# Altium schematic sheet Sheet1.SchDoc
size A4; SheetNumber: 1; SheetTotal: 1
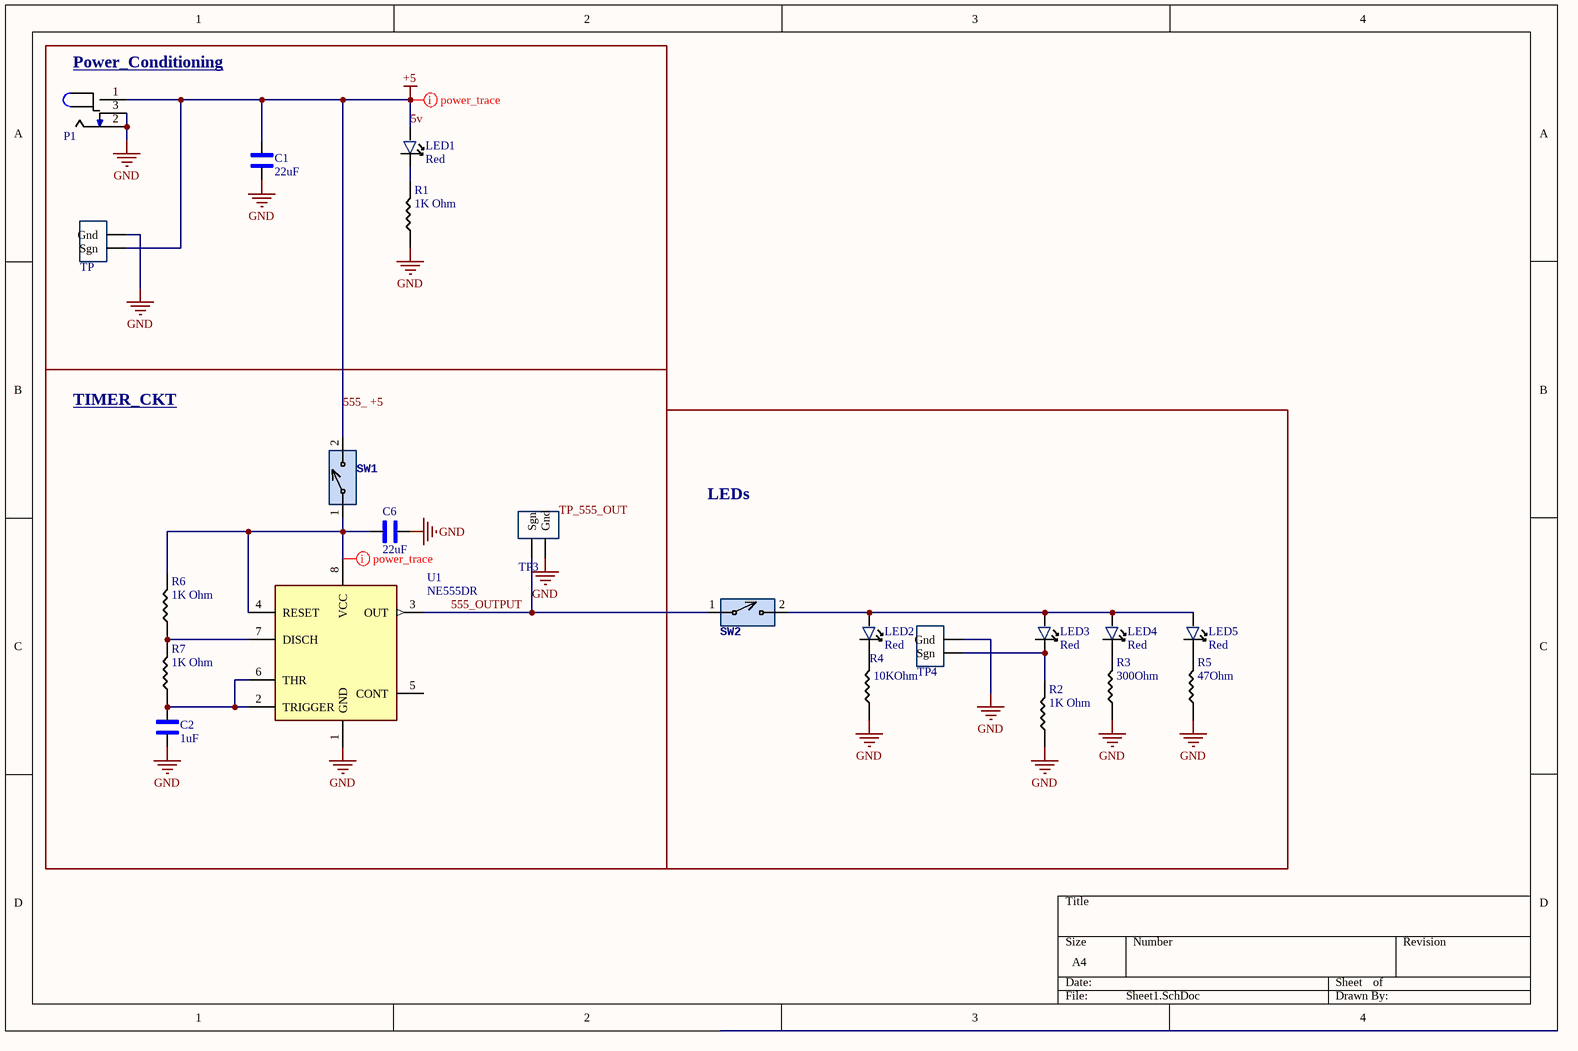
[diagram p0: Sheet1.SchDoc]

## Parts
C1  value 22uF  [1206_Passive_Capacitor]  (hidden comment: 1uF)
C2  1uF  [1206_Passive_Capacitor]
C6  value 22uF  [0402_Passive_Capacitor]  (hidden comment: 22pF)
LED1  value Red  [LED_0603]  (hidden comment: KT-0603R)
LED2  value Red  [LED_0603]  (hidden comment: KT-0603R)
LED3  value Red  [LED_0603]  (hidden comment: KT-0603R)
LED4  value Red  [LED_0603]  (hidden comment: KT-0603R)
LED5  value Red  [LED_0603]  (hidden comment: KT-0603R)
P1  Power Jack  [Power_Jack]  (value not drawn)
R1  value 1K Ohm  [1206_Passive_Resitor]  (hidden comment: 1k)
R2  value 1K Ohm  [1206_Passive_Resitor]  (hidden comment: 1k)
R3  value 300Ohm  [1206_Passive_Resitor]  (hidden comment: 300)
R4  value 10KOhm  [1206_Passive_Resitor]  (hidden comment: 10k)
R5  value 47Ohm  [1206_Passive_Resitor]  (hidden comment: 47 Ohms)
R6  value 1K Ohm  [1206_Passive_Resitor]  (hidden comment: 1k)
R7  value 1K Ohm  [1206_Passive_Resitor]  (hidden comment: 1k)
SW1  on_off_switch  [2Pin-Header-Conn]  (value not drawn)
SW2  SW_2Pin_100mil_Switch  [2Pin-Header-Conn]  (value not drawn)
TP  TP_5V  [TP10x_Probe]  (value not drawn)
TP3  TP_555_OUTPUT  [TP10x_Probe]  (value not drawn)
TP4  10x Probe TP  [TP10x_Probe]  (value not drawn)
U1  NE555DR  [TS555IDTTR]

## Blocks framed on the sheet
Power_Conditioning: C1 LED1 P1 R1 TP
TIMER_CKT: C2 C6 R6 R7 SW1 TP3 U1
LEDs: LED2-LED5 R2-R5 SW2 TP4

## Nets
555_ +5: C1.2 LED1.1 P1.1 SW1.2 TP.1(Sgn)  [also labelled +5, 5v]
GND: C1.1 C2.1 C6.2 P1.2 P1.3 R1.1 R2.1 R3.1 R4.1 R5.1 TP.2(Gnd) TP3.2(Gnd) TP4.2(Gnd) U1.1(GND)
555_OUTPUT: SW2.1 TP3.1(Sgn) U1.3(OUT)
NetC2_2: C2.2 R7.1 U1.2(TRIGGER) U1.6(THR)
NetC6_1: C6.1 R6.2 SW1.1 U1.4(RESET) U1.8(VCC)
NetLED1_2: LED1.2 R1.2
NetLED2_1: LED2.1 LED3.1 LED4.1 LED5.1 SW2.2
NetLED2_2: LED2.2 R4.2
NetLED3_2: LED3.2 R2.2 TP4.1(Sgn)
NetLED4_2: LED4.2 R3.2
NetLED5_2: LED5.2 R5.2
NetR6_1: R6.1 R7.2 U1.7(DISCH)

Not connected (* = marked no-connect by the designer): U1 5(CONT)

## Layout directives
rule Width Constraint [Pref Width = 20mil    Min Width = 10mil    Max Width = 100mil]: 555_ +5, NetC6_1

## Notes on the sheet
- Labels drawn without touching a wire or pin: TP_555_OUT

## Library data of the parts
C1 C2 = C_1uF_1206: MULTILAYER CERAMIC CAPACITORS MLCC - SMD/SMT 1UF 50V 1206 ROHS; MFR Part #: CL31B105KBHNNNE; Type: Basic; Digikey Link: https://www.digikey.com/product-detail/en/C1206C105M4RACTU/399-8150-1-ND/3471873/?itemSeq=304982366; Digikey Part: 399-8150-1-ND; LCSC Part#: C1848
  C2: Value: 1uF
C6 = C_22pF_0402: MULTILAYER CERAMIC CAPACITORS MLCC - SMD/SMT 22PF 50V 0402 ROHS; MFR Part #: 0402CG220J500NT; Type: Basic; Datasheet: https://datasheet.lcsc.com/szlcsc/Guangdong-Fenghua-Advanced-Tech-0402CG220J500NT_C1555.pdf; LCSC Part#: C1555
LED1-LED5 = LED_RED_0603: LIGHT EMITTING DIODES (LED) RED 520~625NM 90~100MCD@20MA TOP VIEW 0603 ROHS; Type: Basic; Datasheet: https://datasheet.lcsc.com/szlcsc/Everlight-Elec-19-217-BHC-ZL1M2RY-3T_C72041.pdf; MFR Part #: KT-0603R; LCSC Part#: C2286
P1 = P_Power Jack: Power Barrel Connector Jack 2.10mm ID (0.083"), 5.50mm OD (0.217") Through Hole, Right Angle; Value: CONN PWR JACK 2X5.5MM SOLDER; Digikey Link: https://www.digikey.com/product-detail/en/PJ-102A/CP-102A-ND/275425/?itemSeq=304982367; Digikey Part: CP-102A-ND; LCSC Part#: C136744; Type: Extended
R1 R2 R6 R7 = R_1K_1206: CHIP RESISTOR - SURFACE MOUNT 1KOHMS ±1% 1/4W 1206 ROHS; MFR Part #: 1206W4F1001T5; Digikey Link: https://www.digikey.com/product-detail/en/RNCP1206FTD1K00/RNCP1206FTD1K00CT-ND/2240675/?itemSeq=304982373; Digikey Part: RNCP1206FTD1K00CT-ND; LCSC Part#: C4410; Type: Basic
R3 = R_300Ohm_1206: CHIP RESISTOR - SURFACE MOUNT 300OHMS ±1% 1/4W 1206 ROHS; MFR Part #: 1206W4F3000T5E; Datasheet: https://datasheet.lcsc.com/szlcsc/Uniroyal-Elec-1206W4F3000T5E_C17887.pdf; LCSC Part#: C17887; Type: Basic
R4 = R_10KOhm_1206: 10 kOhms ±5% 0.25W, 1/4W Chip Resistor 1206 (3216 Metric) Automotive AEC-Q200 Thick Film; Digikey Link: https://www.digikey.com/product-detail/en/RMCF1206JT300R/RMCF1206JT300RCT-ND/1942776/?itemSeq=304982374; Digikey Part: RMCF1206JT300RCT-ND; LCSC Part#: C17902; Type: Basic
R5 = R_47Ohm_1206: 47Ω ±5% 0.25W ±200ppm/℃ 1206 Chip Resistor - Surface Mount RoHS; MFR Part #: 1206W4J0470T5E; LCSC Part#: C25384; Type: Extended; Datasheet: https://datasheet.lcsc.com/lcsc/1811101020_UNI-ROYAL-Uniroyal-Elec-1206W4J0470T5E_C25384.pdf
SW1 SW2 = SW_2Pin_100mil_Switch: 2Pin Header; LCSC Part#: C124375; Type: Extended
TP TP3 TP4 = TP_10x_Probe: Test Point 300 mil centers
U1 = U_555_Slow: 555 Timer SOIC-8_150MIL ROHS 150ns Rise Time; MFR Part #: NE555DR; Digikey Link: https://www.digikey.com/product-detail/en/texas-instruments/NE555DR/296-6501-1-ND/372490; Type: Basic; LCSC Part#: C7593